# Altium schematic sheet DGM01.schdoc
size 127 x 101 mm
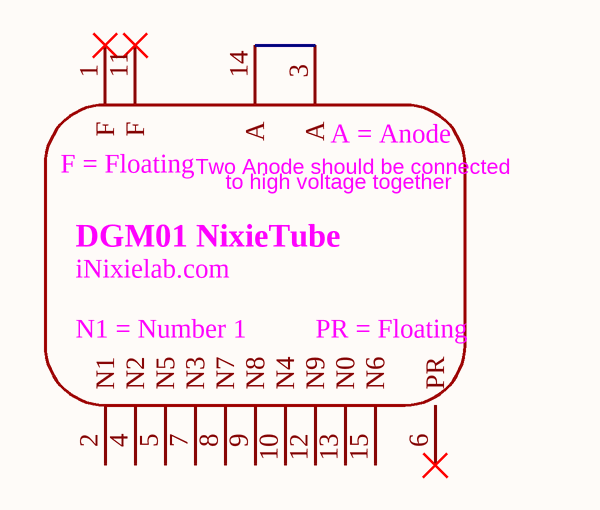
[diagram p0: DGM01.schdoc]

## Parts
U?  (no value)  [DGM01]

## Nets
NetU?_3: U?.3(A) U?.14(A)

Not connected (* = marked no-connect by the designer): U? 1(F)* 2(N1) 4(N2) 5(N5) 6(PR)* 7(N3) 8(N7) 9(N8) 10(N4) 11(F)* 12(N9) 13(N0) 15(N6)

## Notes on the sheet
- (near U?) F = Floating
- (near U?) Two Anode should be connected
- (near U?) to high voltage together
- (near U?) A = Anode
- (near U?) DGM01 NixieTube
- (near U?) N1 = Number 1
- (near U?) iNixielab.com
- (near U?) PR = Floating

## Library data of the parts
U? = DGM01: Add into BOM: yes; Symbol: DGM01; Device: DGM01; Convert to PCB: yes; Comment_1: DGM01